# EasyEDA schematic Zavrsni rad.json
TITLE: Termopar; REV: 1.0; Date: 2021-05-03; Sheet: 1/1; Company: TŠRB
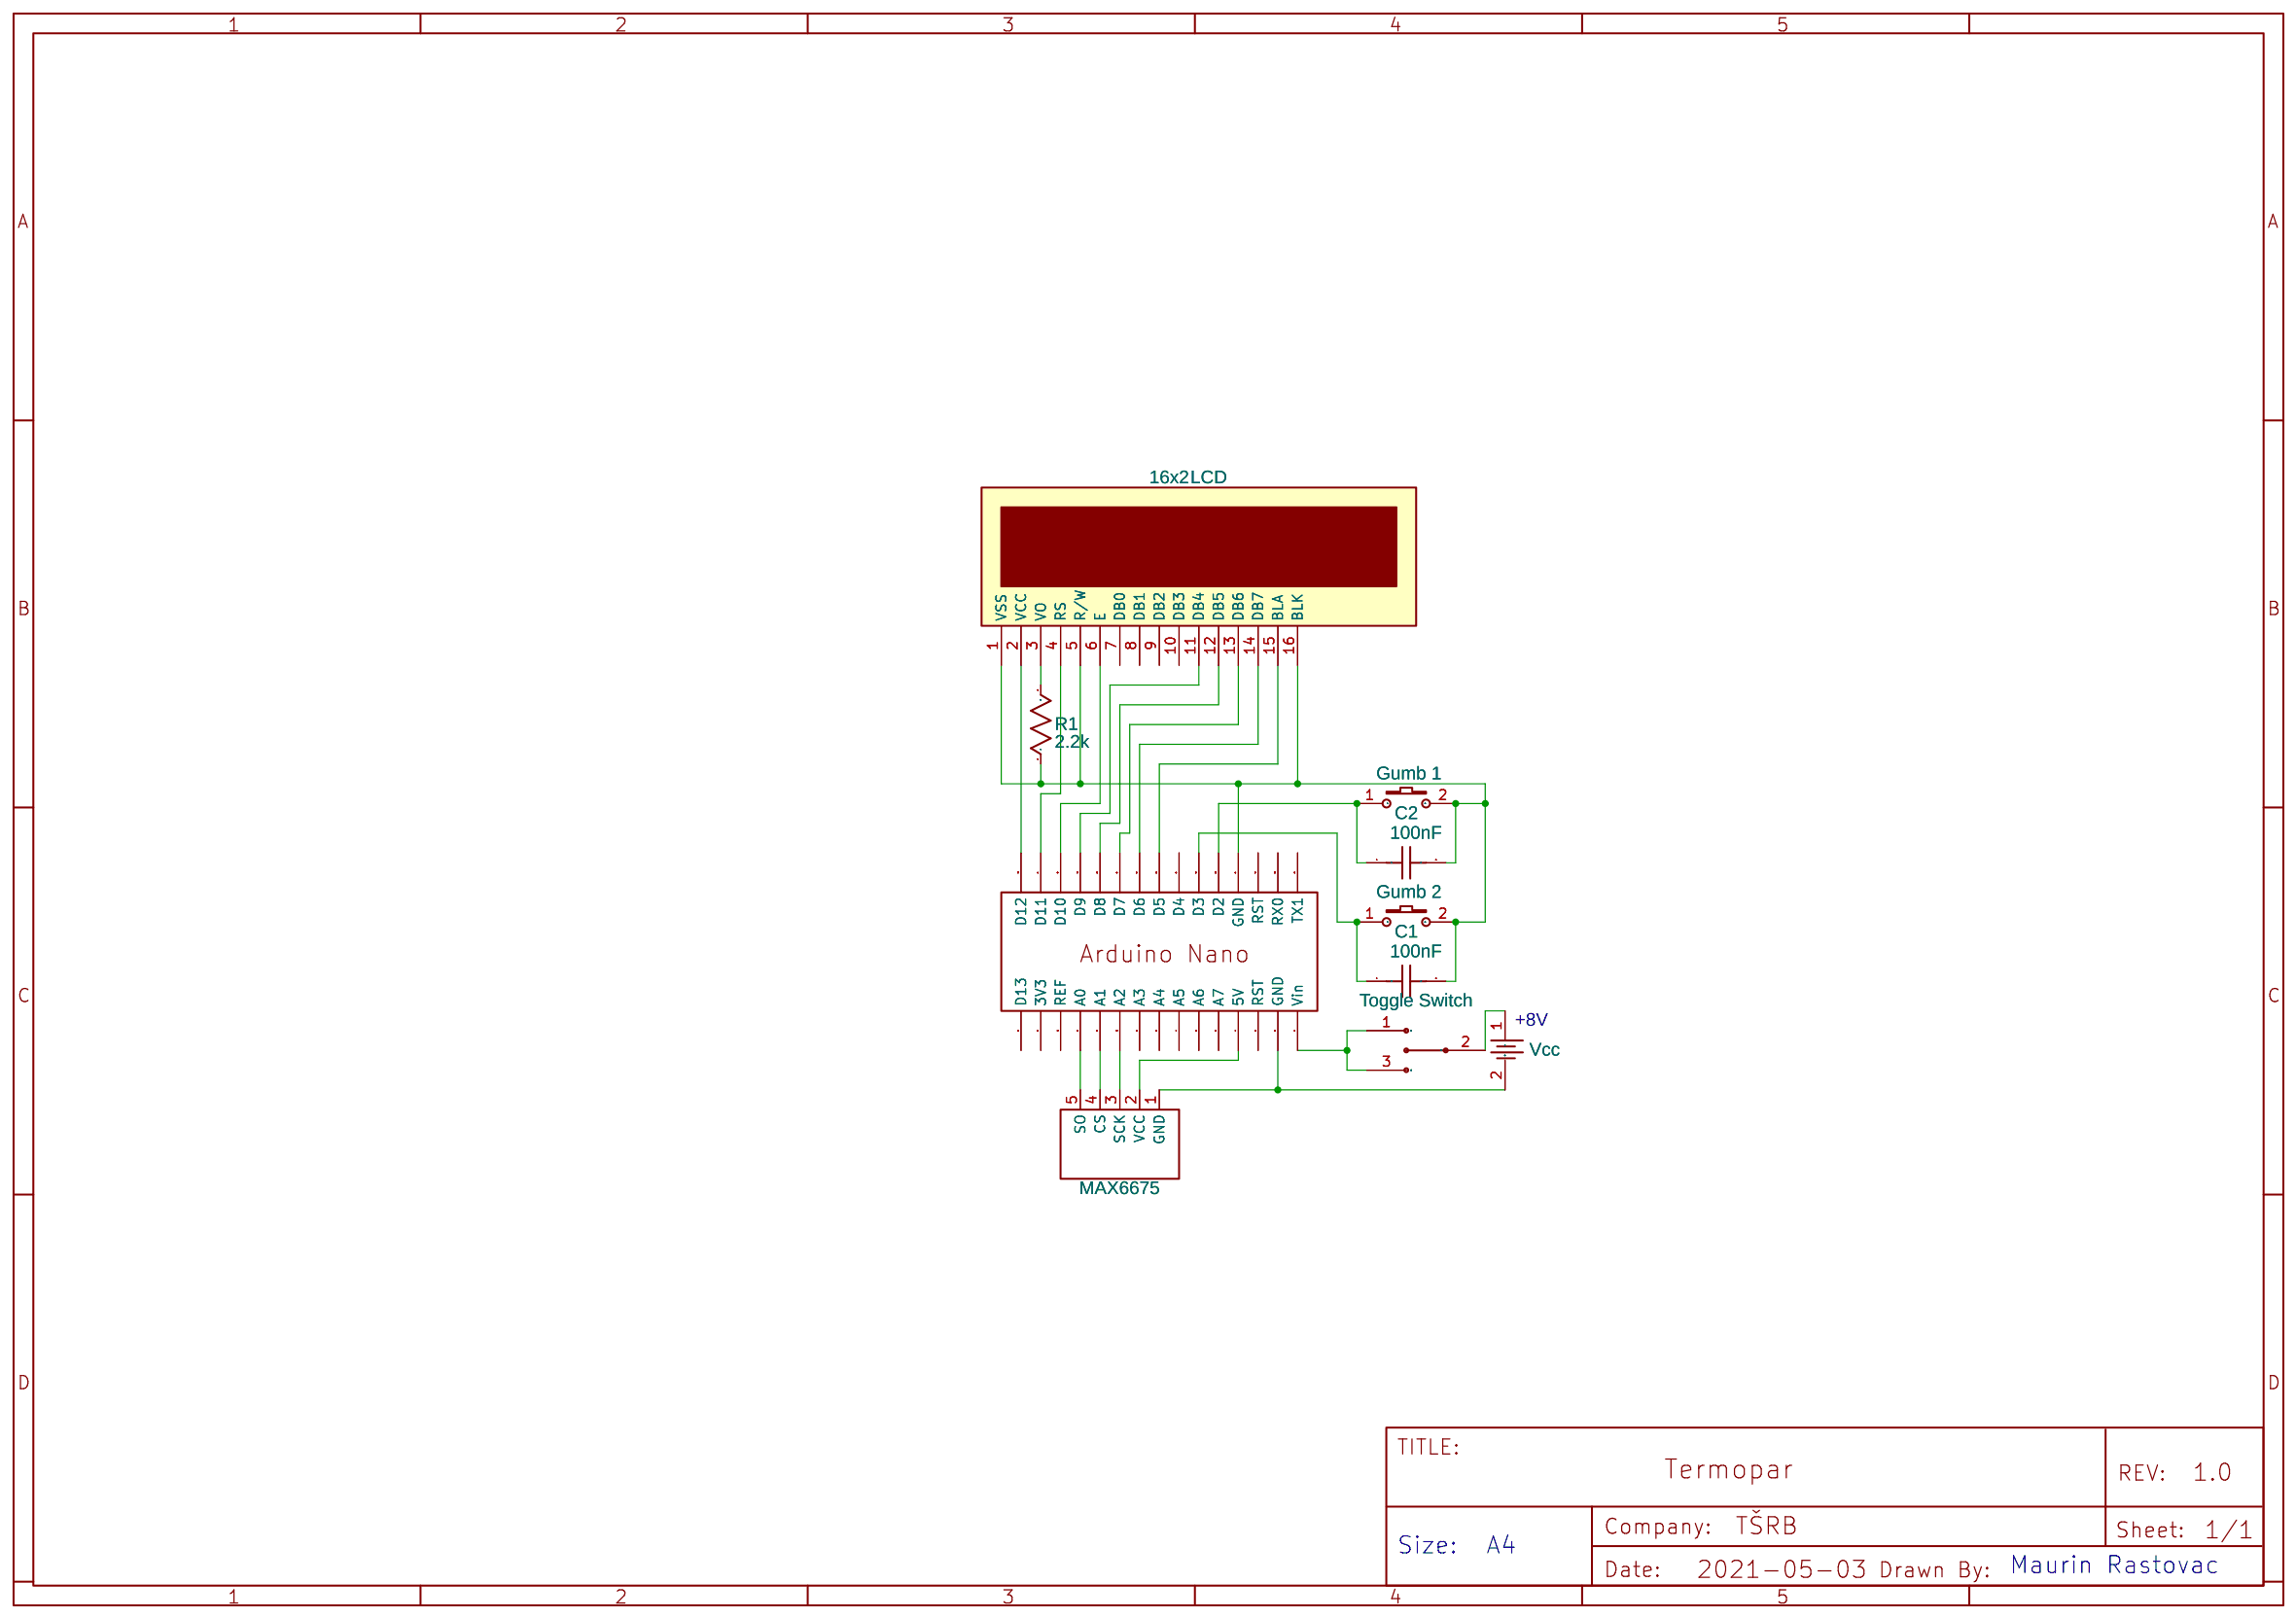
[diagram p0: schematic sheet]

## Parts
B1  Vcc  [BAT-SMD_CR1220-2]
C1  100nF  [C0603]
C2  100nF  [C0603]
KEY2  Gumb 2  [KEY-SMD_2P-L6.2-W3.6-LS8.0]
KEY3  Gumb 1  [KEY-SMD_2P-L6.2-W3.6-LS8.0]
LCD  16x2  [LCD1602]
M1  Arduino_Nano_2  [ARDUINO NANO]
P1  MAX6675  [MAX6675-MODULE]
R1  2.2k  [R0603]
U1  Toggle Switch  [TOGGLE SWITCH]

## Library data of the parts
B1 = CR1220-2: Supplier: LCSC; Manufacturer: Q&J; image: //image.lceda.cn/szlcsc/C70381.jpg; Supplier Part: C70381
C1 C2 = C_0603_US: Contributor: LCEDA_Lib
KEY2 KEY3 = K2-3.6×6.1_SMD: Supplier Part: C118141; Supplier: LCSC; Manufacturer Part: K2-1107ST-A4SW-06; Contributor: LCEDA_Lib; 制造商: 韩国韩荣
LCD = LCD1602: Manufacturer: LONTECH(厦门龙特); Manufacturer Part: LCM1602K-NSW-BBW; Supplier Part: C83275; Supplier: LCSC; Contributor: LCEDA_Lib
M1 = Arduino_Nano_2: Manufacturer Part: Arduino Nano; Contributor: ianm
P1 = MAX6675-MODULE: Supplier: LCSC; Manufacturer: BOOMELE; Manufacturer Part: Female headerHDR1X8-2.54; Supplier Part: C27438; LCSC Assembly: Yes; SMT Type: Extend; Paste Type: expand
R1 = R_0603_US: Contributor: LCEDA_Lib
U1 = Toggle Switch: Contributor: holger.rendel

## Nets
Net-(B1-1): B1.1 U1.2
Net-(B1-2): B1.2 M1.2(GND) P1.1(GND)
Net-(C1-1): C1.1 KEY2.1 M1.25(D3)
Net-(C1-2): C1.2 C2.2 KEY2.2 KEY3.2 LCD.1(VSS) LCD.5(R/W) LCD.16(BLK) M1.27(GND) R1.1
Net-(C2-1): C2.1 KEY3.1 M1.26(D2)
Net-(LCD-2): LCD.2(VCC) M1.16(D12)
Net-(LCD-3): LCD.3(VO) R1.2
Net-(LCD-4): LCD.4(RS) M1.17(D11)
Net-(LCD-6): LCD.6(E) M1.18(D10)
Net-(LCD-11): LCD.11(DB4) M1.19(D9)
Net-(LCD-12): LCD.12(DB5) M1.20(D8)
Net-(LCD-13): LCD.13(DB6) M1.21(D7)
Net-(LCD-14): LCD.14(DB7) M1.22(D6)
Net-(LCD-15): LCD.15(BLA) M1.23(D5)
Net-(M1-1): M1.1(Vin) U1.1 U1.3
Net-(M1-4): M1.4(5V) P1.2(VCC)
Net-(M1-10): M1.10(A2) P1.3(SCK)
Net-(M1-11): M1.11(A1) P1.4(CS)
Net-(M1-12): M1.12(A0) P1.5(SO)

Not connected (* = marked no-connect by the designer): LCD 7(DB0) 8(DB1) 9(DB2) 10(DB3); M1 3(RST) 5(A7) 6(A6) 7(A5) 8(A4) 9(A3) 13(REF) 14(3V3) 15(D13) 24(D4) 28(RST) 29(RX0) 30(TX1)

## Notes on the sheet
- +8V
- Size:
- A4
- Maurin Rastovac
